# Altium schematic sheet STB_Spectrometer.SchDoc: STB  Sensor Board
size A4; Author: flmoll / gruprecht; DrawnBy: flmoll; Organization: PBL; Revision: A; SheetNumber: 3; SheetTotal: 8
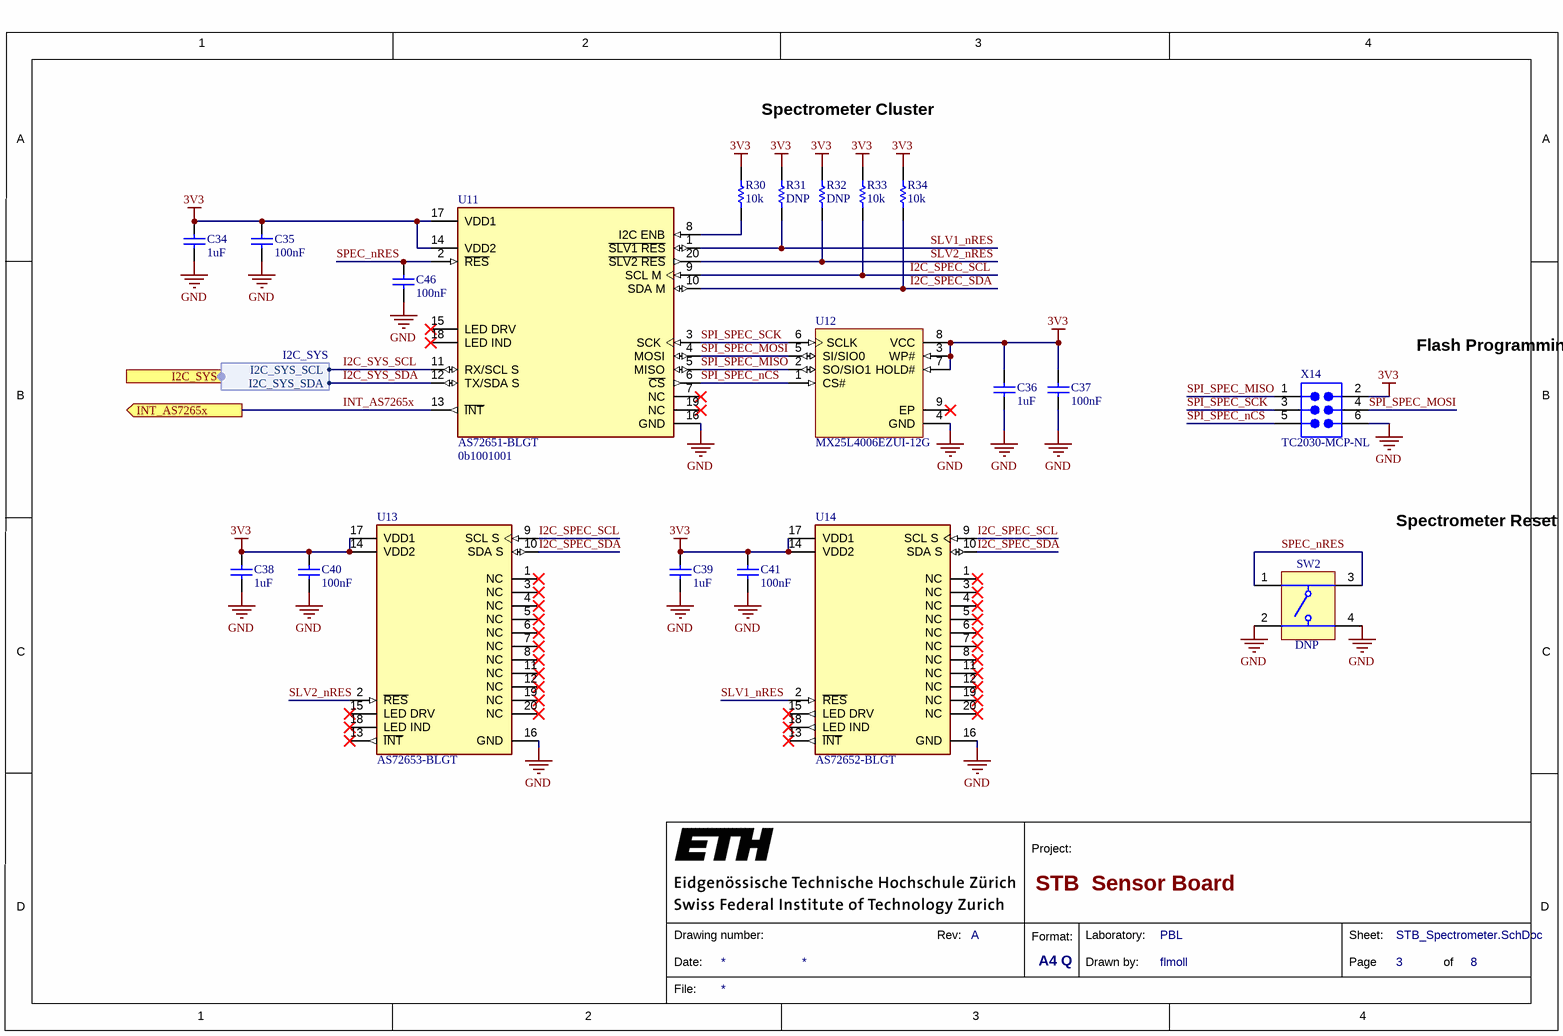
[diagram p0: STB_Spectrometer.SchDoc]

## Parts
C34  1uF  [CAPC1608X90X35LL15T15]
C35  100nF  [CAPC1050X55X23LL05T13]
C36  1uF  [CAPC1608X90X35LL15T15]
C37  100nF  [CAPC1050X55X23LL05T13]
C38  1uF  [CAPC1608X90X35LL15T15]
C39  1uF  [CAPC1608X90X35LL15T15]
C40  100nF  [CAPC1050X55X23LL05T13]
C41  100nF  [CAPC1050X55X23LL05T13]
C46  100nF  [CAPC1050X55X23LL05T13]
R30  10k  [RESC1005X40X25LL05T05]
R31  DNP  [RESC1005X40X25LL05T05]
R32  DNP  [RESC1005X40X25LL05T05]
R33  10k  [RESC1005X40X25LL05T05]
R34  10k  [RESC1005X40X25LL05T05]
SW2  DNP  [PNSC-EVPAA_V]
U11  AS72651-BLGT  Address: 0b1001001  [FP-AS72651-BLGT-MFG]
U12  MX25L4006EZUI-12G  [MXIC-USON-8_V]
U13  AS72653-BLGT  [FP-AS72653-BLGT-MFG]
U14  AS72652-BLGT  [FP-AS72652-BLGT-MFG]
X14  TC2030-MCP-NL  [TC2030-MCP-NL]  (no BOM)

## Ports
I2C_SYS (harness I2C_SYS), INT_AS7265x (out)

## Harnesses
I2C_SYS: I2C_SYS_SDA, I2C_SYS_SCL

## Nets
3V3: C34.2 C35.2 C36.2 C37.2 C38.2 C39.2 C40.2 C41.2 R30.2 R31.2 R32.2 R33.2 R34.2 U11.14(VDD2) U11.17(VDD1) U12.3(WP#) U12.7(HOLD#) U12.8(VCC) U13.14(VDD2) U13.17(VDD1) U14.14(VDD2) U14.17(VDD1) X14.2
GND: C34.1 C35.1 C36.1 C37.1 C38.1 C39.1 C40.1 C41.1 C46.1 SW2.2(B) SW2.4(B') U11.16(GND) U12.4(GND) U13.16(GND) U14.16(GND) X14.6
I2C_SPEC_SCL: R33.1 U11.9(SCL_M) U13.9(SCL_S) U14.9(SCL_S)
I2C_SPEC_SDA: R34.1 U11.10(SDA_M) U13.10(SDA_S) U14.10(SDA_S)
I2C_SYS_SCL: U11.11(RX/SCL_S) ; port I2C_SYS.I2C_SYS_SCL
I2C_SYS_SDA: U11.12(TX/SDA_S) ; port I2C_SYS.I2C_SYS_SDA
INT_AS7265x: U11.13(~{INT}) ; port INT_AS7265x
SLV1_nRES: R31.1 U11.1(~{SLV1_RES}) U14.2(~{RES})
SLV2_nRES: R32.1 U11.20(~{SLV2_RES}) U13.2(~{RES})
SPEC_nRES: C46.2 SW2.1(A) SW2.3(A') U11.2(~{RES})
SPI_SPEC_MISO: U11.5(MISO) U12.2(SO/SIO1) X14.1
SPI_SPEC_MOSI: U11.4(MOSI) U12.5(SI/SIO0) X14.4
SPI_SPEC_nCS: U11.6(~{CS}) U12.1(CS#) X14.5
SPI_SPEC_SCK: U11.3(SCK) U12.6(SCLK) X14.3
NetR30_1: R30.1 U11.8(I2C_ENB)

Not connected (* = marked no-connect by the designer): U11 7(NC)* 15(LED_DRV)* 18(LED_IND)* 19(NC)*; U12 9(EP)*; U13 1(NC)* 3(NC)* 4(NC)* 5(NC)* 6(NC)* 7(NC)* 8(NC)* 11(NC)* 12(NC)* 13(~{INT})* 15(LED_DRV)* 18(LED_IND)* 19(NC)* 20(NC)*; U14 1(NC)* 3(NC)* 4(NC)* 5(NC)* 6(NC)* 7(NC)* 8(NC)* 11(NC)* 12(NC)* 13(~{INT})* 15(LED_DRV)* 18(LED_IND)* 19(NC)* 20(NC)*

## Notes on the sheet
- Spectrometer Cluster
- (near X14) Flash Programming Port
- Spectrometer Reset
- 1
- 2
- 3
- 4
- A
- B
- C
- Project:
- D
- Date:
- Drawing number:
- Rev:
- Format:
- A4 Q
- Drawn by:
- Laboratory:
- Page
- Sheet:
- of
- File:

## Library data of the parts
C34 C36 C38 C39 = CMP-2006-02298-2: Manufacturer: Kemet; Part Number: C0603C105K4RACTU; Dielectric Material: Ceramic; Multilayer: Yes; Negative Tolerance: 10%; Rated DC Voltage (URdc): 16V; Temperature Characteristics Code: X7R; Supplier 1: Digi-Key; Supplier Part Number 1: 399-C0603C105K4RAC7867DKR-ND; Manufacturer Part Number: C0603C105K4RACTU; RoHS: Yes; Category: Ceramic Capacitors; Stock 1: 1549593; Pricing 1: 1=0.10000, 10=0.07700, 50=0.04180, 100=0.03410, 500=0.02440, 1000=0.01916 (USD); Mount: Surface Mount; Number of Pins: 2; Package Shape: Rectangular; Size Code: 0603; Terminal Finish: Nickel; Min Operating Temperature: -55°C; Max Operating Temperature: 125°C; Value: 1uF; Capacitor Type: Ceramic; Packaging: Tape and Reel; Positive Tolerance: 10%; Termination: Wraparound; JESD-609 Code: e3; Package Style: SMTMeter; Length: 1.6mm; Width: 0.8mm; Height: 0.8mm; REACH SVHC: Yes; RoHS Compliant: Yes; ComponentLink1URL: https://datasheet.ciiva.com:443/pdfs/VipMasterIC/IC/KEME/KEME-S-A0008991654/KEME-S-A0008991654-1.pdf?src-supplier=IHS+Markit; ComponentLink1Description: https://datasheet.ciiva.com:443/pdfs/VipMasterIC/IC/KEME/KEME-S-A0008991654/KEME-S-A0008991654-1.pdf?src-supplier=IHS+Markit
C35 C37 C40 C41 C46 = CMP-2000-05439-1: Chip Capacitor, 100 nF, +/- 10%, 16 V, -55 to 125 degC, 0402 (1005 Metric), RoHS, Tape and Reel; Manufacturer: Samsung Electro-Mechanics; Manufacturer Part Number: CL05B104KO5NNNC; Dielectric: X7R; Rated Voltage: 16V; Dielectric Material: Ceramic; Multilayer: Yes; Case Size/Dimension: 0402; Tolerance (%): ±10%; Value: 100nF; Manufacturer URL: http://www.samsungsem.com/global/index.jsp; Datasheet URL: https://datasheet.ciiva.com/29198/458718-da-01-en-vs-kondensator-0402-29198423.pdf; Datasheet Version: Nov-10; Supplier 1: Digi-Key; Supplier Part Number 1: 1276-1001-6-ND; RoHS: Yes; Category: Ceramic Capacitors; Stock 1: 24854634; Pricing 1: 1=0.10000, 10=0.02400, 50=0.01300, 100=0.01050, 500=0.00752, 1000=0.00592, 2500=0.00538, 5000=0.00495 (USD); Mount: Surface Mount; Number of Pins: 2; Package Shape: Rectangular; Size Code: 0402; Terminal Finish: Nickel; Min Operating Temperature: -55°C; Max Operating Temperature: 125°C; JESD-609 Code: e3; Capacitor Type: Ceramic; Negative Tolerance: 10%; Packaging: Tape and Reel; Positive Tolerance: 10%; Rated DC Voltage (URdc): 16V; Temperature Characteristics Code: X7R; Termination: Wraparound; Package Style: SMTMeter; Length: 1mm; Width: 0.5mm; Height: 0.55mm; REACH SVHC: Yes; RoHS Compliant: Yes; ComponentLink1URL: https://datasheet.ciiva.com:443/pdfs/VipMasterIC/IC/SEMS/SEMS-S-A0008384515/SEMS-S-A0008872921-1.pdf?src-supplier=IHS+Markit; ComponentLink1Description: https://datasheet.ciiva.com:443/pdfs/VipMasterIC/IC/SEMS/SEMS-S-A0008384515/SEMS-S-A0008872921-1.pdf?src-supplier=IHS+Markit; ComponentLink2URL: https://datasheet.ciiva.com/26920/getdatasheetpartid-359683-26920169.pdf?src-supplier=Verical; ComponentLink2Description: https://datasheet.ciiva.com/26920/getdatasheetpartid-359683-26920169.pdf?src-supplier=Verical; ComponentLink3URL: https://datasheet.ciiva.com/29198/458718-da-01-en-vs-kondensator-0402-29198423.pdf?src-supplier=Conrad; ComponentLink3Description: https://datasheet.ciiva.com/29198/458718-da-01-en-vs-kondensator-0402-29198423.pdf?src-supplier=Conrad; ComponentLink4URL: https://datasheet.ciiva.com/26309/mlcc-catalogdownload2013-eng-26309003.pdf?src-supplier=Distrelec; ComponentLink4Description: https://datasheet.ciiva.com/26309/mlcc-catalogdownload2013-eng-26309003.pdf?src-supplier=Distrelec; ComponentLink5URL: https://datasheet.ciiva.com/16208/cl05b104kq5nnnc-16208343.pdf?src-supplier=Future+Electronics; ComponentLink5Description: https://datasheet.ciiva.com/16208/cl05b104kq5nnnc-16208343.pdf?src-supplier=Future+Electronics
R30-R34 = CMP-2000-07588-1: Chip Resistor, 10 KOhm, +/- 1%, 0.1 W, -55 to 155 degC, 0402 (1005 Metric), RoHS, Tape and Reel; Manufacturer: Panasonic; Manufacturer Part Number: ERJ-2RKF1002X; Power Rating: 100mW; Voltage Rating: 50V; Value: 10 kOhm; Case\/Package: 0402; Temperature Coefficient: 100ppm\/degreesC; Rated Temperature: 70°C; Package Height: 0.35mm; Package Length: 1mm; Package Width: 0.5mm; Reference Standard: AEC-Q200; RoHSCompliant: True; Lead Free: LeadFree; Package Quantity: 1; Contact Plating: Tin; Length: 1mm; Radiation Hardening: No; REACH SVHC: NoSVHC; Max Operating Temperature: 155degC; Depth: 0.5mm; Case Code (Imperial): 0402; Military Standard: Not; Package Description: 2-Pin Surface Mount Device, Body 1 x 0.5 mm; Termination: SMD/SMT; Case Code (Metric): 1005; Height: 0.35mm; Packaging: TapeandReel; Voltage Rating (DC): 50V; Package Reference: 402; Number of Pins: 2; Tolerance: 1%; Mounting Technology: SurfaceMount; Width: 0.02inch; Mount: SurfaceMount; Datasheet URL: https://industrial.panasonic.com/cdbs/www-data/pdf/RDA0000/AOA0000C304.pdf; Composition: ThickFilm; Datasheet Version: 02/2017; Manufacturer URL: http://www.panasonic.com/; Max Power Dissipation: 100mW; Number of Terminations: 2; Min Operating Temperature: -55degC; Supplier 1: Digi-Key; Supplier Part Number 1: P10.0KLDKR-ND; RoHS: Yes; Category: Chip SMD Resistors; Stock 1: 108; Pricing 1: 1=0.10000, 10=0.03300, 100=0.01330, 1000=0.00599, 2500=0.00520, 5000=0.00429 (USD); Size Code: 0402; Terminal Finish: Nickel; Package Shape: Rectangular; Resistor Type: FIXED RESISTOR; Rated Power Dissipation (P): 100mW; Technology: METAL GLAZE/THICK FILM; Working Voltage: 50V; Construction: Rectangular; Package Style: SMTMeter; JESD-609 Code: e3; RoHS Compliant: Yes; ComponentLink1URL: https://datasheet.ciiva.com:443/pdfs/VipMasterIC/IC/PANA/PANA-S-A0009889626/PANA-S-A0009889626-1.pdf?src-supplier=IHS+Markit; ComponentLink1Description: https://datasheet.ciiva.com:443/pdfs/VipMasterIC/IC/PANA/PANA-S-A0009889626/PANA-S-A0009889626-1.pdf?src-supplier=IHS+Markit; ComponentLink2URL: https://datasheet.ciiva.com/11821/0900766b80f80784-11821171.pdf?src-supplier=RSComponents; ComponentLink2Description: https://datasheet.ciiva.com/11821/0900766b80f80784-11821171.pdf?src-supplier=RSComponents; ComponentLink3URL: https://datasheet.ciiva.com/27055/1987020-27055643.pdf?src-supplier=Jameco; ComponentLink3Description: https://datasheet.ciiva.com/27055/1987020-27055643.pdf?src-supplier=Jameco; ComponentLink4URL: https://datasheet.ciiva.com/43467/1678782-43467402.pdf?src-supplier=Farnell; ComponentLink4Description: https://datasheet.ciiva.com/43467/1678782-43467402.pdf?src-supplier=Farnell; ComponentLink5URL: https://datasheet.ciiva.com/28514/1678782-28514185.pdf?src-supplier=Element14; ComponentLink5Description: https://datasheet.ciiva.com/28514/1678782-28514185.pdf?src-supplier=Element14; ComponentLink6URL: https://datasheet.ciiva.com/24023/aoa0000ce2-24023017.pdf?src-supplier=Mouser; ComponentLink6Description: https://datasheet.ciiva.com/24023/aoa0000ce2-24023017.pdf?src-supplier=Mouser; ComponentLink7URL: https://datasheet.ciiva.com/16782/70260748-16782590.pdf?src-supplier=Allied+Electronics; ComponentLink7Description: https://datasheet.ciiva.com/16782/70260748-16782590.pdf?src-supplier=Allied+Electronics; ComponentLink8URL: https://datasheet.ciiva.com/16786/70260748-16786734.pdf?src-supplier=Allied+Electronics; ComponentLink8Description: https://datasheet.ciiva.com/16786/70260748-16786734.pdf?src-supplier=Allied+Electronics; ComponentLink9URL: https://datasheet.ciiva.com/9194/aoa0000ce2-9194142.pdf?src-supplier=Avnet; ComponentLink9Description: https://datasheet.ciiva.com/9194/aoa0000ce2-9194142.pdf?src-supplier=Avnet; ComponentLink10URL: https://datasheet.ciiva.com/16199/aoa0000ce2-16199478.pdf?src-supplier=Future+Electronics; ComponentLink10Description: https://datasheet.ciiva.com/16199/aoa0000ce2-16199478.pdf?src-supplier=Future+Electronics; ComponentLink11URL: https://datasheet.ciiva.com/48531/aoa0000ce2-48531069.pdf?src-supplier=Avnet; ComponentLink11Description: https://datasheet.ciiva.com/48531/aoa0000ce2-48531069.pdf?src-supplier=Avnet; ComponentLink12URL: https://datasheet.ciiva.com/30201/aoa0000ce2-30201022.pdf?src-supplier=Onlinecomponents.com; ComponentLink12Description: https://datasheet.ciiva.com/30201/aoa0000ce2-30201022.pdf?src-supplier=Onlinecomponents.com
SW2 = CMP-2000-06231-1: Light Touch Switch, 100 mOhm, -40 to 85 degC, 4-Pin SMD, RoHS, Tape and Reel; Manufacturer: Panasonic; Part No: EVP-AA002K; Manufacturer Series: EVPAA; Electrical Life: 1000000Cycles; Switch Configuration: N.O.; COO: JP; Actuator Color: Black; Contact Rating @ Voltage: 0.02@15VDCA; Dielectric Strength: 250VAC; Actuator Length: 0.3mm; Ground Terminal: No; Operating Force: 1N; Pole Throw Configuration: SPST; Body Orientation: Straight; Illumination Type: N/R; Maximum DC Voltage Rating: 15V; Actuator Style: RectangularButton; Actuator Angle: 0°; Actuator Travel: 0.127mm; Actuator Type: Pushbutton; Circuit Configuration: 1X1; Contact Bounce Time-Max: 10ms; Contact Current(DC)-Max: 20mA; Contact DC Max Rating R Load: .02A@15VDC; Contact Function: OFF-(ON); Contact Resistance: 0.1mR; Contact Timing: SNAP ACTION; Dielectric Withstand Volts: 250VACV; Insulation Resistance: 100MR; Number of Switches: 1; Switch Action: MOMENTARY; Switch Type: Keypad; Body Breadth: 2.9inch; Body Height: 1.4mm; Body Length or Diameter: 3.5mm; Sealing: MOLDED; Maximum AC Voltage Rating: N/A; Package Description: 4-Pin Surface Mount Device, Body 2.9 x 3.5 mm, Pitch 1.45 mm; Family: EVPAA; Contact Material: N/A; Mounting: SurfaceMount,J-Bend; Datasheet Version: 04/2016; Housing Material: N/A; Product Weight: N/A; RoHS: Yes; Mechanical Life: N/A; Minimum Insulation Resistance: 100MOhm; Operating Temperature: -40to85C; Mounting Technology: SurfaceMount; HTS: 8507204000; Dimension: 4.3x2.9x1.7mm; Maximum Contact Resistance: 100mOhm; Base Material: N/A; Seal Location: N/A; Supplier Standard Pack: 5,000; Supplier: PanasonicIndustrialDevices; Datasheet URL: https://industrial.panasonic.com/cdbs/www-data/pdf/ATV0000/ATV0000C1.pdf; Packaging: EmbossedTapeandReel; Manufacturer URL: http://www.panasonic.com/; Seal Description: N/A; Contact Plating: N/A; ECCN: EAR99; Package Reference: EVPAA; Type: LightTouch; Supplier 1: Digi-Key; Supplier Part Number 1: P13347SDKR-ND; Manufacturer Part Number: EVP-AA002K; Category: Tactile Switches; Stock 1: 2300; Pricing 1: 1=0.87000, 10=0.83400, 25=0.80200, 100=0.69610, 250=0.63516, 500=0.59026, 1000=0.52930, 2500=0.49722 (USD); Mount: Surface Mount; Body Color: Black; Min Operating Temperature: -40°C; Max Operating Temperature: 85°C; Contact Voltage(DC)-Max: 15V; Operating Force-Max: 1N; Switch Function: SPST; Termination: Solder; REACH SVHC: Yes; RoHS Compliant: Yes; ComponentLink1URL: https://datasheet.ciiva.com:443/pdfs/VipMasterIC/IC/PANA/PANA-S-A0001791376/PANA-S-A0001791376-1.pdf?src-supplier=IHS+Markit; ComponentLink1Description: https://datasheet.ciiva.com:443/pdfs/VipMasterIC/IC/PANA/PANA-S-A0001791376/PANA-S-A0001791376-1.pdf?src-supplier=IHS+Markit; ComponentLink2URL: https://datasheet.ciiva.com/24076/atk0000pe184-69004-24076293.pdf?src-supplier=Mouser; ComponentLink2Description: https://datasheet.ciiva.com/24076/atk0000pe184-69004-24076293.pdf?src-supplier=Mouser; ComponentLink3URL: https://datasheet.ciiva.com/30108/atk0000ce26-30108515.pdf?src-supplier=Onlinecomponents.com; ComponentLink3Description: https://datasheet.ciiva.com/30108/atk0000ce26-30108515.pdf?src-supplier=Onlinecomponents.com; ComponentLink4URL: https://datasheet.ciiva.com/17016/70270676-17016874.pdf?src-supplier=Allied+Electronics; ComponentLink4Description: https://datasheet.ciiva.com/17016/70270676-17016874.pdf?src-supplier=Allied+Electronics; ComponentLink5URL: https://datasheet.ciiva.com/16395/atk0000ce26-16395244.pdf?src-supplier=Future+Electronics; ComponentLink5Description: https://datasheet.ciiva.com/16395/atk0000ce26-16395244.pdf?src-supplier=Future+Electronics; ComponentLink6URL: https://datasheet.ciiva.com/2899/atk0000ce26-2899991.pdf?src-supplier=Digi-Key; ComponentLink6Description: https://datasheet.ciiva.com/2899/atk0000ce26-2899991.pdf?src-supplier=Digi-Key; ComponentLink7URL: https://datasheet.ciiva.com/2899/atk0000ce26-2899992.pdf?src-supplier=Digi-Key; ComponentLink7Description: https://datasheet.ciiva.com/2899/atk0000ce26-2899992.pdf?src-supplier=Digi-Key; ComponentLink8URL: https://datasheet.ciiva.com/2899/atk0000ce26-2899990.pdf?src-supplier=Digi-Key; ComponentLink8Description: https://datasheet.ciiva.com/2899/atk0000ce26-2899990.pdf?src-supplier=Digi-Key
U11 = CMP-22831-000005-1: AS72651-BLGT LGA20 LF T&RDP; Manufacturer: ams; Frequency: 50MHz; Frequency Stability: 25ppm; Max Supply Current: 8mA; Min Operating Temperature: -40°C; Max Operating Temperature: 85°C; Mount: Surface Mount; Number of Pins: 20; Packaging: Tape and Reel; Case/Package: SMD/SMT; Supplier 1: Digi-Key; Supplier Part Number 1: AS72651-BLGTDKR-ND; Manufacturer Part Number: AS72651-BLGT; RoHS: No; Category: LED Drivers; ComponentLink1URL: https://ams.com/documents/20143/36005/AS7265x_DS000612_1-00.pdf?src-supplier=Digi-Key; ComponentLink1Description: https://ams.com/documents/20143/36005/AS7265x_DS000612_1-00.pdf?src-supplier=Digi-Key
U12 = CMP-0467-00001-2: 4 M-Bit [x1 / x2] CMOS Serial Flash, 86 MHz, -0.7 to 3.6 V, -40 to 85 degC, Body  2 x 3 x 0.6 mm; Manufacturer: Macronix; Frequency(MHz): 86; Density: 4 Mb; Bus Width: x1, x2; Sector Type: 4 KB, 64 KB; Operating Current(mA): 12; Vin: -2.7 to 3.6 V; Standby Current(uA): 10; Package Body Material: Plastic; Alternate Memory Width: 1; Clock Frequency-Max (fCLK): 86MHz; Memory Width: 2; Number of Words: 2097152; Number of Words Code: 2M; Operating Mode: SYNCHRONOUS; Organization: 2MX2; Programming Voltage: 2.7V; Supply Voltage-Max (Vsup): 3.6V; Supply Voltage-Nom (Vsup): 3V; Data Retention Time-Min: 20; Endurance: 100000Cycles; Power Supplies: 3/3.3V; Serial Bus Type: SPI; Standby Current-Max: 10uA; Max Supply Current: 20uA; Write Protection: HARDWARE/SOFTWARE; Qualification Status: Not Qualified; Operationg Tempertaure Range: -40 to 85 degC; ComponentLink3Description: Package Specification; PackageReference: USON-8; PartNumber: MX25L4006EZUI-12G; Mounting Technology: Surface Mount; ComponentLink1Description: Manufacturer URL; ComponentLink2URL: http://www.macronix.com/QuickPlace/hq/PageLibrary4825740B00298A3B.nsf/h_Index/3F21BAC2E121E17848257639003A3146/$File/MX25L4006E,%203V,%204Mb,%20v1.3.pdf; ComponentLink1URL: http://www.macronix.com; PackageDescription: 8-Pin Small Outline No-lead Package, Body 2 x 3mm, Pitch 0.5 mm; ComponentLink3URL: http://www.macronix.com/QuickPlace/hq/PageLibrary4825740B00298A3B.nsf/h_Index/3F21BAC2E121E17848257639003A3146/$File/MX25L4006E,%203V,%204Mb,%20v1.3.pdf; PackageVersion: Rev. 3; ComponentLink2Description: Datasheet; DatasheetVersion: Rev. 1.3; Supplier 1: Digi-Key; Supplier Part Number 1: 1092-1154-1-ND; Manufacturer Part Number: MX25L4006EZUI-12G; RoHS: Yes; Category: Flash; Stock 1: 48100; Pricing 1: 1=0.73000, 10=0.66700, 25=0.65880, 50=0.65480, 100=0.58540, 250=0.58048, 500=0.57188, 1000=0.55143, 5000=0.50226 (USD); Package Code: HVSON; Number of Pins: 8; Package Shape: Rectangular; Terminal Finish: Tin; Min Operating Temperature: -40°C; Max Operating Temperature: 85°C; JESD-609 Code: e3; Memory Type: FLASH; Type: NOR TYPE; JESD-30 Code: R-PDSO-N8; Moisture Sensitivity Level: 3; Number of Functions: 1; Package Style: SMALL OUTLINE, HEAT SINK/SLUG, VERY THIN PROFILEMeter; Parallel/Serial: SERIAL; Supply Voltage-Min (Vsup): 2.7V; Surface Mount: Yes; Technology: CMOS; Terminal Form: No Lead; Terminal Position: DUAL; Length: 3mm; Width: 2mm; Height - Seated (Max): 0.6mm; Terminal Pitch: 0.5mm; Temperature Grade: INDUSTRIAL; REACH SVHC: No SVHC; RoHS Compliant: Yes; ComponentLink4URL: https://datasheet.ciiva.com:443/pdfs/VipMasterIC/IC/MXMA/MXMA-S-A0007770252/MXMA-S-A0007770252-1.pdf?src-supplier=IHS+Markit; ComponentLink4Description: https://datasheet.ciiva.com:443/pdfs/VipMasterIC/IC/MXMA/MXMA-S-A0007770252/MXMA-S-A0007770252-1.pdf?src-supplier=IHS+Markit; ComponentLink5URL: http://www.macronix.com/Lists/Datasheet/Attachments/5087/MX25L4006E,%203V,%204Mb,%20v1.6.pdf?src-supplier=Digi-Key; ComponentLink5Description: http://www.macronix.com/Lists/Datasheet/Attachments/5087/MX25L4006E,%203V,%204Mb,%20v1.6.pdf?src-supplier=Digi-Key; ComponentLink6URL: http://ckassoc.com/oldsite/pdf/Macronix_Product_Line_Card_July_2017_General%20_070617.pdf?src-supplier=Digi-Key; ComponentLink6Description: http://ckassoc.com/oldsite/pdf/Macronix_Product_Line_Card_July_2017_General%20_070617.pdf?src-supplier=Digi-Key; ComponentLink7URL: http://www.macronix.com/Lists/Datasheet/Attachments/7604/MX25L4006E,%203V,%204Mb,%20v1.7.pdf?src-supplier=Digi-Key; ComponentLink7Description: http://www.macronix.com/Lists/Datasheet/Attachments/7604/MX25L4006E,%203V,%204Mb,%20v1.7.pdf?src-supplier=Digi-Key; ComponentLink8URL: http://www.macronix.com/QuickPlace/hq/PageLibrary4825740B00298A3B.nsf/h_Index/3F21BAC2E121E17848257639003A3146/$File/MX25L4006E,%203V,%204Mb,%20v1.4.pdf?src-supplier=Future+Electronics; ComponentLink8Description: http://www.macronix.com/QuickPlace/hq/PageLibrary4825740B00298A3B.nsf/h_Index/3F21BAC2E121E17848257639003A3146/$File/MX25L4006E,%203V,%204Mb,%20v1.4.pdf?src-supplier=Future+Electronics
U13 = CMP-22831-000003-1: AS72653-BLGT LGA20 LF T&RDP; Manufacturer: ams; Packaging: Cut Tape; Number of Pins: 20; Case/Package: LGA; Mount: Surface Mount; Supplier 1: Digi-Key; Supplier Part Number 1: AS72653-BLGTDKR-ND; Manufacturer Part Number: AS72653-BLGT; RoHS: No; Category: LED Drivers; ComponentLink1URL: https://ams.com/documents/20143/36005/AS7265x_DS000612_1-00.pdf?src-supplier=Digi-Key; ComponentLink1Description: https://ams.com/documents/20143/36005/AS7265x_DS000612_1-00.pdf?src-supplier=Digi-Key
U14 = CMP-22831-000001-1: AS72652-BLGT LGA20 LF T&RDP; Manufacturer: ams; Packaging: Cut Tape; Case/Package: LGA; Number of Pins: 20; Mount: Surface Mount; Supplier 1: Digi-Key; Supplier Part Number 1: AS72652-BLGTDKR-ND; Manufacturer Part Number: AS72652-BLGT; RoHS: No; Category: LED Drivers; ComponentLink1URL: https://ams.com/documents/20143/36005/AS7265x_DS000612_1-00.pdf?src-supplier=Digi-Key; ComponentLink1Description: https://ams.com/documents/20143/36005/AS7265x_DS000612_1-00.pdf?src-supplier=Digi-Key
X14 = CMP-00723-1: CABLE, TAG CONNECT, WITH OUT LEG, FOR IC; Number of Pins: 6; Package Quantity: 1; Packaging: Bulk; REACH SVHC: No SVHC; Lead Free: Lead Free